# Altium schematic sheet Top.SchDoc
size A4
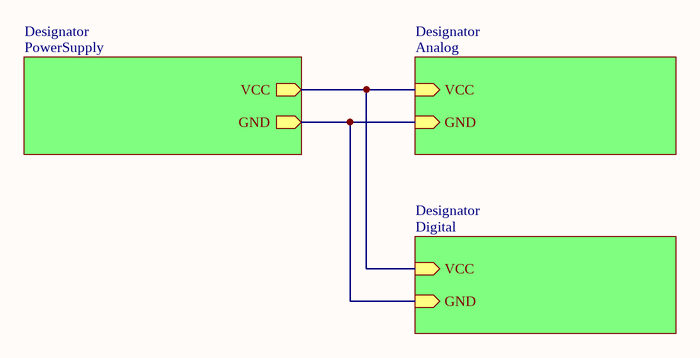
[diagram p0: Top.SchDoc]

## Sub-sheets
Designator = PowerSupply: VCC (out), GND (out)
Designator = Analog: VCC (in), GND (in)
Designator = Digital: VCC (in), GND (in)

## Nets
(unnamed): sheet Designator/VCC, sheet Designator/VCC, sheet Designator/VCC
(unnamed): sheet Designator/GND, sheet Designator/GND, sheet Designator/GND